# Altium schematic sheet PICO核心.SchDoc
size A3
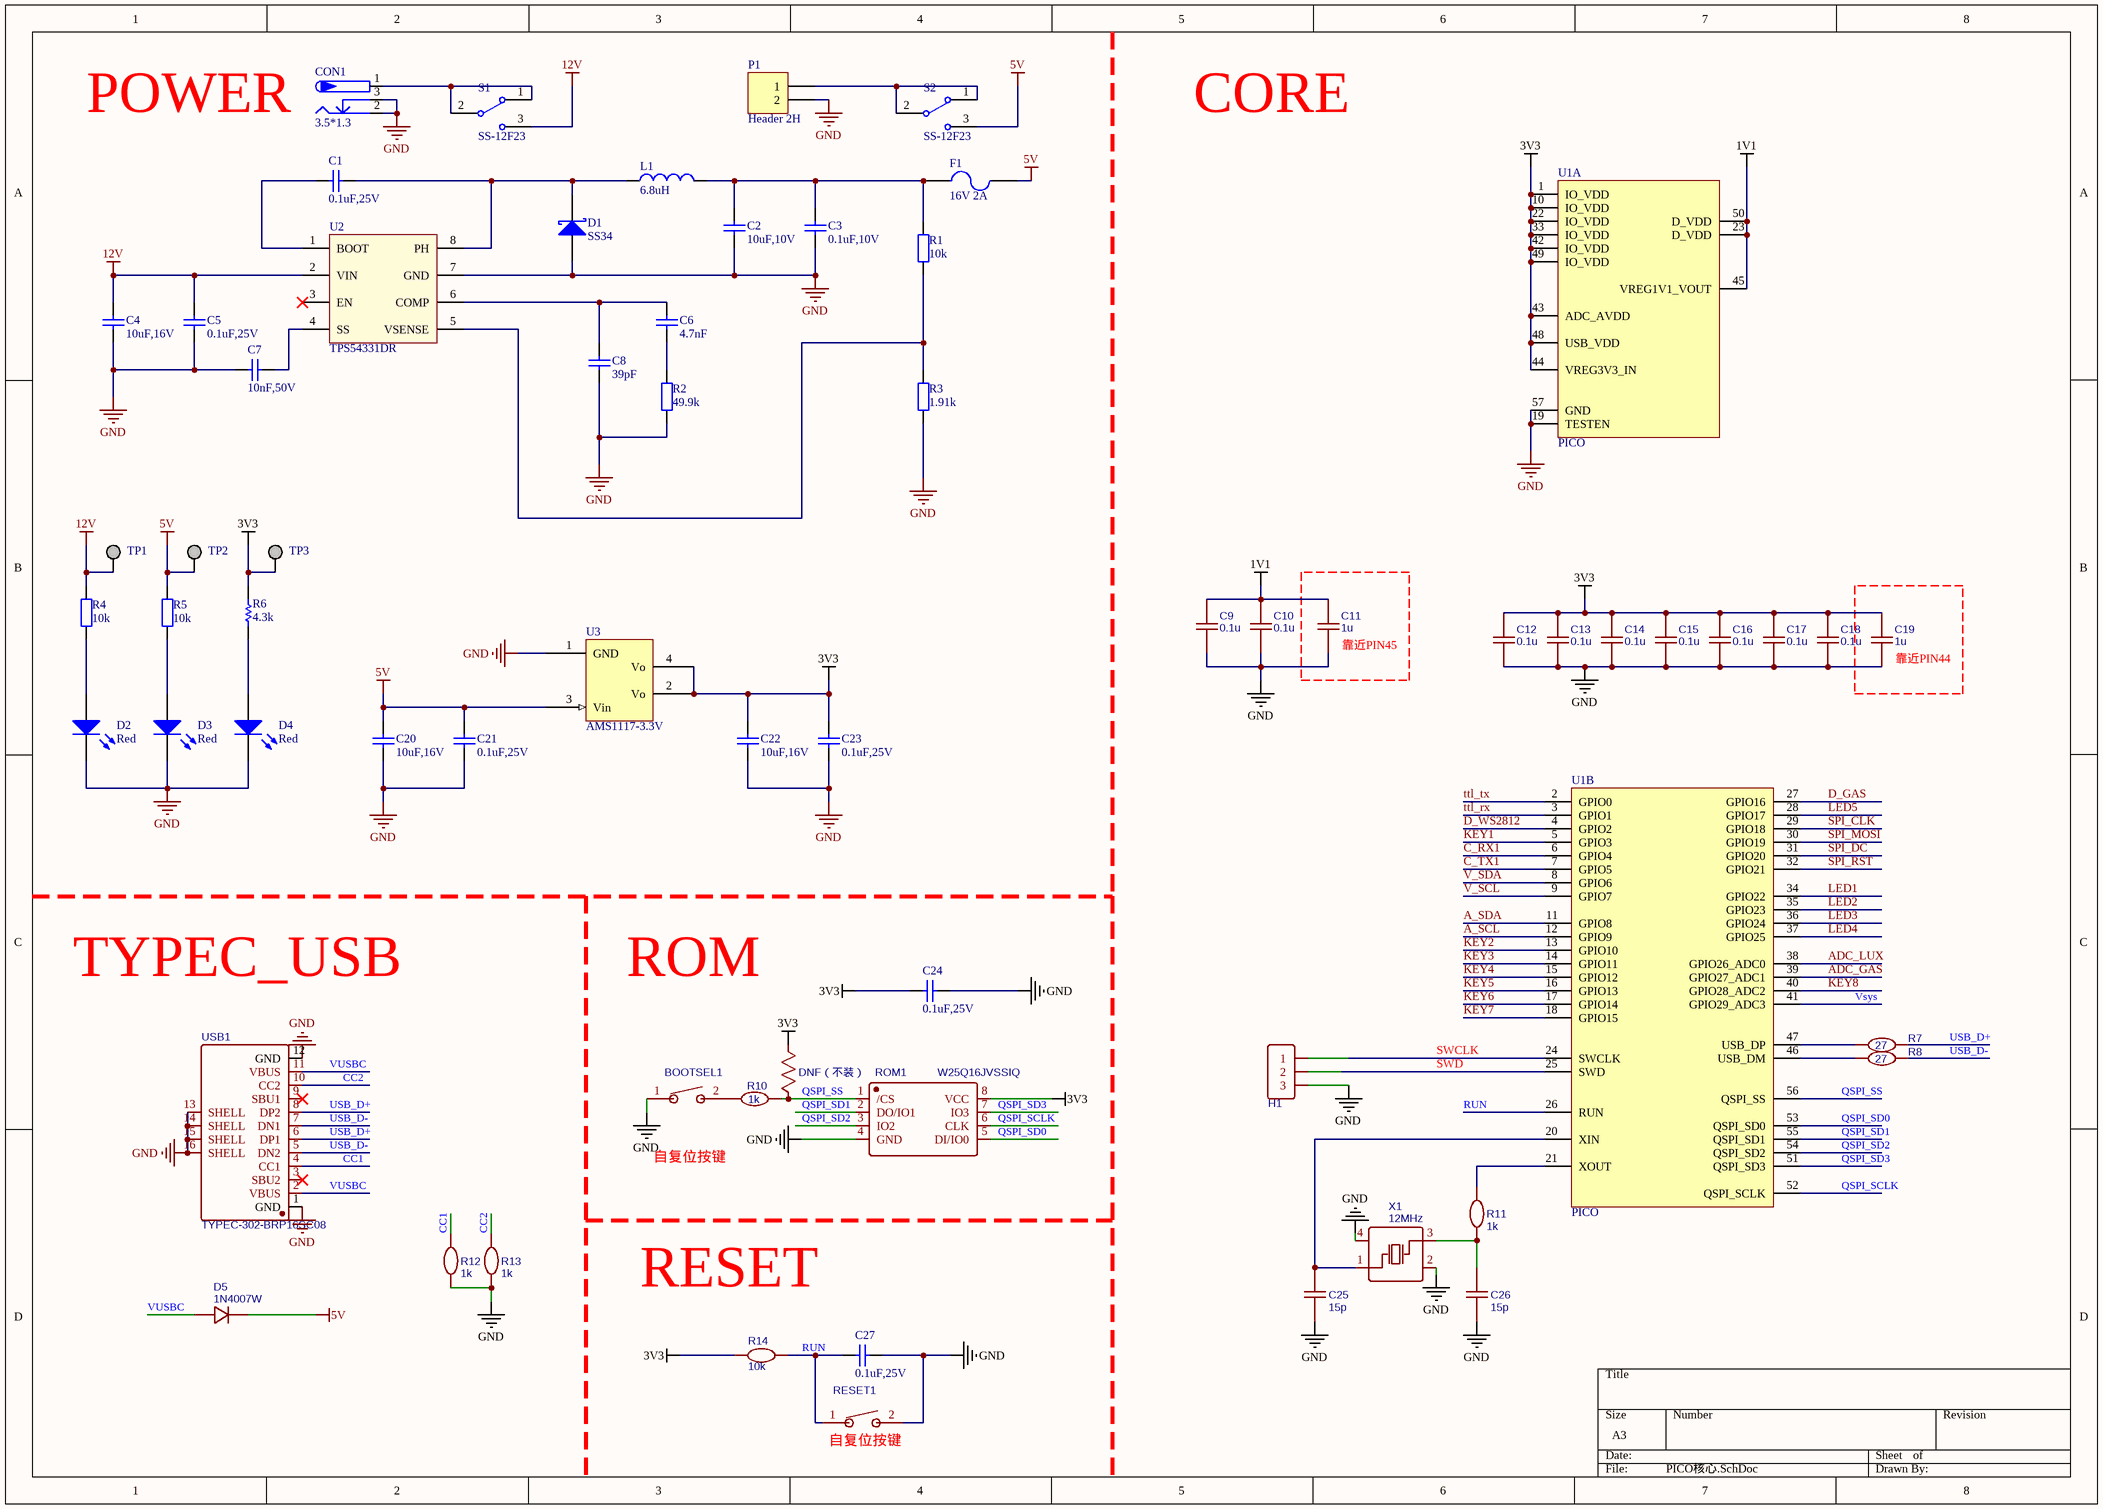
[diagram p0: PICO核心.SchDoc]

## Parts
BOOTSEL1  TSA343G00-250J2  [SW-SMD_4P-L6.2-W6.3-P4.00-LS9.4]  (value not drawn)
C1  value 0.1uF,25V  [0402_C]  (hidden comment: Cap)
C2  value 10uF,10V  [0402_C]  (hidden comment: Cap)
C3  value 0.1uF,10V  [1206_C]  (hidden comment: Cap)
C4  value 10uF,16V  [0402_C]  (hidden comment: Cap)
C5  value 0.1uF,25V  [0402_C]  (hidden comment: Cap)
C6  4.7nF  [0402_C]
C7  value 10nF,50V  [0402_C]  (hidden comment: Cap)
C8  39pF  [0402_C]
C9  0.1u  [0402_C]
C10  0.1u  [0402_C]
C11  1u  [0402_C]
C12  0.1u  [0402_C]
C13  0.1u  [0402_C]
C14  0.1u  [0402_C]
C15  0.1u  [0402_C]
C16  0.1u  [0402_C]
C17  0.1u  [0402_C]
C18  0.1u  [0402_C]
C19  1u  [0402_C]
C20  value 10uF,16V  [0402_C]  (hidden comment: Cap)
C21  value 0.1uF,25V  [0402_C]  (hidden comment: Cap)
C22  value 10uF,16V  [0402_C]  (hidden comment: Cap)
C23  value 0.1uF,25V  [0402_C]  (hidden comment: Cap)
C24  value 0.1uF,25V  [0402_C]  (hidden comment: Cap)
C25  15p  [0402_C]
C26  15p  [0402_C]
C27  value 0.1uF,25V  [0402_C]  (hidden comment: Cap)
CON1  3.5*1.3  [DC-IN-TH_DC-005-5A-2.5]
D1  value SS34  [SMA_L4.3-W2.6-LS5.2-RD]  (hidden comment: Diode Schottky)
D2  value Red  [0603_LED]  (hidden comment: LED)
D3  value Red  [0603_LED]  (hidden comment: LED)
D4  value Red  [0603_LED]  (hidden comment: LED)
D5  1N4007W  [SMA_L4.3-W2.6-LS5.2-RD]
F1  16V 2A  [1206_FUSE]
H1  HDR-F-2.54_1x3  [XH2.54A-3]  (value not drawn)
L1  6.8uH  [IND-SMD_L5.8-W5.2]
P1  Header 2H  [XH2.54A-2]
R1  value 10k  [0402_R]  (hidden comment: Res)
R2  49.9k  [0402_R]
R3  1.91k  [0402_R]
R4  value 10k  [0402_R]  (hidden comment: Res)
R5  value 10k  [0402_R]  (hidden comment: Res)
R6  value 4.3k  [0402_R]  (hidden comment: Res_5%)
R7  27  [0402_R]
R8  27  [0402_R]
R9  DNF（不装）  [0402_R]
R10  1k  [0402_R]
R11  1k  [0402_R]
R12  1k  [0402_R]
R13  1k  [0402_R]
R14  10k  [0402_R]
RESET1  TSA343G00-250J2  [SW-SMD_4P-L6.2-W6.3-P4.00-LS9.4]  (value not drawn)
ROM1  W25Q16JVSSIQ  [SOIC8-208mil]
S1  SS-12F23  [SW-TH_MT-0-103-A101-M200-RS]
S2  SS-12F23  [SW-TH_MT-0-103-A101-M200-RS]
TP1  TP  [TP_H]  (value not drawn)  (no BOM)
TP2  TP  [TP_H]  (value not drawn)  (no BOM)
TP3  TP  [TP_H]  (value not drawn)  (no BOM)
U1  PICO  [LQFN-56_L7.0-W7.0-P0.4-EP]  (parts A,B of 2)
U2  TPS54331DR  [SOIC8E]
U3  value AMS1117-3.3V  [SOT223]  (hidden comment: AMS1117)
USB1  TYPEC-302-BRP16SC08  [USB-C-SMD_TYPEC-302-BRP16SC08]
X1  12MHz  [OSC 3225-4P]

## Blocks framed on the sheet
靠近PIN45: C11
靠近PIN44: C19

## Nets
1V1: C9.1 C10.1 C11.2 U1.23(D_VDD) U1.45(VREG1V1_VOUT) U1.50(D_VDD)
3V3: C12.1 C13.2 C14.2 C15.2 C16.2 C17.2 C18.2 C19.2 C22.2 C23.2 C24.2 R6.2 R9.2 R14.2 ROM1.8(VCC) TP3.1 U1.1(IO_VDD) U1.10(IO_VDD) U1.22(IO_VDD) U1.33(IO_VDD) U1.42(IO_VDD) U1.43(ADC_AVDD) U1.44(VREG3V3_IN) U1.48(USB_VDD) U1.49(IO_VDD) U3.2(Vo) U3.4(Vo)
5V: C20.2 C21.2 D5.1 F1.2 R5.2 S2.3 TP2.1 U3.3(Vin)
12V: C4.2 C5.2 R4.2 S1.3 TP1.1 U2.2(VIN)
GND: BOOTSEL1.1 C2.1 C3.1 C4.1 C5.1 C7.2 C8.1 C9.2 C10.2 C11.1 C12.2 C13.1 C14.1 C15.1 C16.1 C17.1 C18.1 C19.1 C20.1 C21.1 C22.1 C23.1 C24.1 C25.1 C26.1 C27.2 CON1.2 CON1.3 D1.1(A) D2.2(K) D3.2(K) D4.2(K) H1.3 P1.2 R2.1 R3.1 R12.1 R13.1 RESET1.2 ROM1.4(GND) U1.19(TESTEN) U1.57(GND) U2.7(GND) U3.1(GND) USB1.1(GND) USB1.12(GND) USB1.13(SHELL) USB1.14(SHELL) USB1.15(SHELL) USB1.16(SHELL) X1.2(GND) X1.4(GND)
A_SCL: U1.12(GPIO9)
A_SDA: U1.11(GPIO8)
ADC_GAS: U1.39(GPIO27_ADC1)
ADC_LUX: U1.38(GPIO26_ADC0)
C_RX1: U1.6(GPIO4)
C_TX1: U1.7(GPIO5)
CC1: R12.2 USB1.4(CC1)
CC2: R13.2 USB1.10(CC2)
D_GAS: U1.27(GPIO16)
D_WS2812: U1.4(GPIO2)
KEY1: U1.5(GPIO3)
KEY2: U1.13(GPIO10)
KEY3: U1.14(GPIO11)
KEY4: U1.15(GPIO12)
KEY5: U1.16(GPIO13)
KEY6: U1.17(GPIO14)
KEY7: U1.18(GPIO15)
KEY8: U1.40(GPIO28_ADC2)
LED1: U1.34(GPIO22)
LED2: U1.35(GPIO23)
LED3: U1.36(GPIO24)
LED4: U1.37(GPIO25)
LED5: U1.28(GPIO17)
QSPI_SCLK: ROM1.6(CLK) U1.52(QSPI_SCLK)
QSPI_SD0: ROM1.5(DI/IO0) U1.53(QSPI_SD0)
QSPI_SD1: ROM1.2(DO/IO1) U1.55(QSPI_SD1)
QSPI_SD2: ROM1.3(IO2) U1.54(QSPI_SD2)
QSPI_SD3: ROM1.7(IO3) U1.51(QSPI_SD3)
QSPI_SS: R9.1 R10.2 ROM1.1(/CS) U1.56(QSPI_SS)
RUN: C27.1 R14.1 RESET1.1 U1.26(RUN)
SPI_CLK: U1.29(GPIO18)
SPI_DC: U1.31(GPIO20)
SPI_MOSI: U1.30(GPIO19)
SPI_RST: U1.32(GPIO21)
ttl_rx: U1.3(GPIO1)
ttl_tx: U1.2(GPIO0)
USB_D+: R7.2 USB1.6(DP1) USB1.8(DP2)
USB_D-: R8.2 USB1.5(DN2) USB1.7(DN1)
V_SCL: U1.9(GPIO7)
V_SDA: U1.8(GPIO6)
Vsys: U1.41(GPIO29_ADC3)
VUSBC: D5.2 USB1.2(VBUS) USB1.11(VBUS)
NetBOOTSEL1_2: BOOTSEL1.2 R10.1
NetC1_1: C1.1 D1.2(K) L1.1 U2.8(PH)
NetC1_2: C1.2 U2.1(BOOT)
NetC2_2: C2.2 C3.2 F1.1 L1.2 R1.2
NetC6_1: C6.1 R2.2
NetC6_2: C6.2 C8.2 U2.6(COMP)
NetC7_1: C7.1 U2.4(SS)
NetC25_2: C25.2 U1.20(XIN) X1.1(OSC1)
NetC26_2: C26.2 R11.1 X1.3(OSC2)
NetCON1_1: CON1.1 S1.1 S1.2
NetD2_1: D2.1(A) R4.1
NetD3_1: D3.1(A) R5.1
NetD4_1: D4.1(A) R6.1
NetH1_1: H1.1 U1.24(SWCLK)
NetH1_2: H1.2 U1.25(SWD)
NetP1_1: P1.1 S2.1 S2.2
NetR1_1: R1.1 R3.2 U2.5(VSENSE)
NetR7_1: R7.1 U1.47(USB_DP)
NetR8_1: R8.1 U1.46(USB_DM)
NetR11_2: R11.2 U1.21(XOUT)

Not connected (* = marked no-connect by the designer): U2 3(EN)*; USB1 3(SBU2)* 9(SBU1)*

## Notes on the sheet
- POWER
- CORE
- TYPEC_USB
- ROM
- SWCLK
- SWD
- 自复位按键
- RESET
- (near RESET1) 自复位按键

## Library data of the parts
BOOTSEL1 RESET1 = TSA343G00-250J2: BOM_Manufacturer: BRIGHT; Contributor: LCSC; BOM_Supplier: LCSC; BOM_Supplier Part: C354946; BOM_Manufacturer Part: TSA343G00-250J2; BOM_JLCPCB Part Class: Extended Part; spicePre: S; spiceSymbolName: TSA343G00-250J2
C1 C5 C21 C23 C24 C27 = T_Cap_0603_0.1uF_25V_X5R: 贴片电容; Part Typer: X5R; Solder: SMD; Withstand Voltage: 25V; Tolerance: 10%; Schematic Path: X:\Database\Schematic Library.Schlib; Part Number: T_Cap_0603_0.1uF_25V_X5R; LibRef: T_Cap_0603_0.1uF_25V_X5R
C2 C3 = T_Cap_1206_47uF_10V_X5R: 贴片电容; Part Typer: X5R; Solder: SMD; Withstand Voltage: 10V; Tolerance: 10%; Schematic Path: X:\Database\Schematic Library.Schlib; Part Number: T_Cap_1206_47uF_10V_X5R; LibRef: T_Cap_1206_47uF_10V_X5R
C4 C20 C22 = T_Cap_0603_10uF_16V_X5R: 贴片电容; Part Typer: X5R; Solder: SMD; Withstand Voltage: 16V; Tolerance: 10%; Schematic Path: X:\Database\Schematic Library.Schlib; Part Number: T_Cap_0603_10uF_16V_X5R; LibRef: T_Cap_0603_10uF_16V_X5R
C6 C8 = Cap
C7 = T_Cap_0603_10nF_50V_X7R: 贴片电容; Part Typer: X7R; Solder: SMD; Withstand Voltage: 50V; Tolerance: 10%; Schematic Path: X:\Database\Schematic Library.Schlib; Part Number: T_Cap_0603_10nF_50V_X7R; LibRef: T_Cap_0603_10nF_50V_X7R
C9-C19 = 0.1u: nameAlias: Value(F); Contributor: LCEDA_Lib; spicePre: C; spiceSymbolName: C_0603_US
C25 = 15p: nameAlias: Value(F); Contributor: LCEDA_Lib; spicePre: C; spiceSymbolName: C_0603_US
C26 = 15p: nameAlias: Value(F); Contributor: LCEDA_Lib; Package Display: No; spicePre: C; spiceSymbolName: C_0603_US
CON1 = P-DC: 低压电源接口; BOM名称: DC电源接口; 版权归属: 源创客; 学习资源: www.ooocke.com
D1 = T_SS34: 肖特基二极管; Part Number: T_SS34; Solder: SMD; Schematic Path: X:\Database\Schematic Library.Schlib; LibRef: T_SS34
D2-D4 = T_LED_Red_0805: 红色LED灯; Solder: SMD; Schematic Path: X:\Database\Schematic Library.Schlib; Part Number: T_LED_Red_0805; LibRef: T_LED_Red_0805
D5 = 1N4007W: BOM_Manufacturer: BLUE ROCKET; Contributor: LCEDA_Lib; BOM_Supplier: LCSC; BOM_Supplier Part: C328592; BOM_Manufacturer Part: 1N4007W; spicePre: D; spiceSymbolName: 1N4007W
F1 = Fuse
H1 = HDR-F-2.54_1x3: Contributor: LCEDA_Lib; BOM_Supplier Part: C146690; BOM_Supplier: LCSC; spicePre: H; spiceSymbolName: HDR-F-2.54_1x3
L1 = Inductor
P1 = Header 2H: Header, 2-Pin, Right Angle; LatestRevisionDate: 17-Jul-2002; LatestRevisionNote: Re-released for DXP Platform.; Publisher: Altium Limited
R1 R4 R5 = T_Res_0603_10k_1%_1/10W: 贴片电阻; Solder: SMD; Power: 1/10W; Tolerance: 1%; Schematic Path: X:\Database\Schematic Library.Schlib; Part Number: T_Res_0603_10k_1%_1/10W; LibRef: T_Res_0603_10k_1%_1/10W
R2 R3 = Res
R6 = T_Res_0603_4.3k_5%_1/10W: 贴片电阻; Solder: SMD; Power: 1/10W; Tolerance: 5%; Schematic Path: X:\Database\Schematic Library.Schlib; Part Number: T_Res_0603_4.3k_5%_1/10W; LibRef: T_Res_0603_4.3k_5%_1/10W
R7 R8 = 27: nameAlias: Value(Ω); Contributor: LCEDA_Lib; spicePre: R; spiceSymbolName: R_0603_EU
R9 = DNF（不装）: nameAlias: Value(Ω); Contributor: LCEDA_Lib; spicePre: R; spiceSymbolName: R_0603_US
R10-R14 = 1k: nameAlias: Value(Ω); Contributor: LCEDA_Lib; spicePre: R; spiceSymbolName: R_0603_EU
ROM1 = W25Q16JVSSIQ: BOM_Manufacturer: WINBOND; BOM_Supplier: LCSC; BOM_Manufacturer Part: W25Q16JVSSIQ; BOM_Supplier Part: C82317; BOM_JLCPCB Part Class: Extended Part; spicePre: U; spiceSymbolName: W25Q16JVSSIQ
S1 S2 = SSW-1P: 1路波动开关; BOM名称: 波动开关; 版权归属: 源创客; 学习资源: www.ooocke.com
TP1-TP3 = T_TestPoint_H: 测试点_过孔; Solder: DIP; Schematic Path: X:\Database\Schematic Library.Schlib; Part Number: T_TestPoint_H; LibRef: T_TestPoint_H
U1 = PICO_CORE
U2 = TPS54331: TI, 3A, 3.5-28V, Buck
U3 = T_AMS1117-3.3V: 电源芯片; Solder: SMD; Schematic Path: X:\Database\Schematic Library.Schlib; Part Number: T_AMS1117-3.3V; LibRef: T_AMS1117-3.3V; ComponentLink2Description: Datasheet; ComponentLink2URL: X:\Database\Datasheet\AMS1117.pdf
USB1 = TYPEC-302-BRP16SC08: BOM_Manufacturer: XUNPU(讯普); Contributor: LCSC; BOM_Supplier: LCSC; BOM_Supplier Part: C2835312; BOM_Manufacturer Part: TYPEC-302-BRP16SC08; spicePre: U; spiceSymbolName: TYPEC-302-BRP16SC08
X1 = 12MHz: BOM_Manufacturer: YXC; BOM_Manufacturer Part: X322512MLB4SI; nameAlias: Frequency; BOM_Supplier: LCSC; BOM_Supplier Part: C112971; BOM_JLCPCB Part Class: Extended Part; spicePre: X; spiceSymbolName: X322512MLB4SI